# EAGLE schematic quad_fc_v1 (EAGLE 9.6.1)

## Sheet 1 of 5: MCU
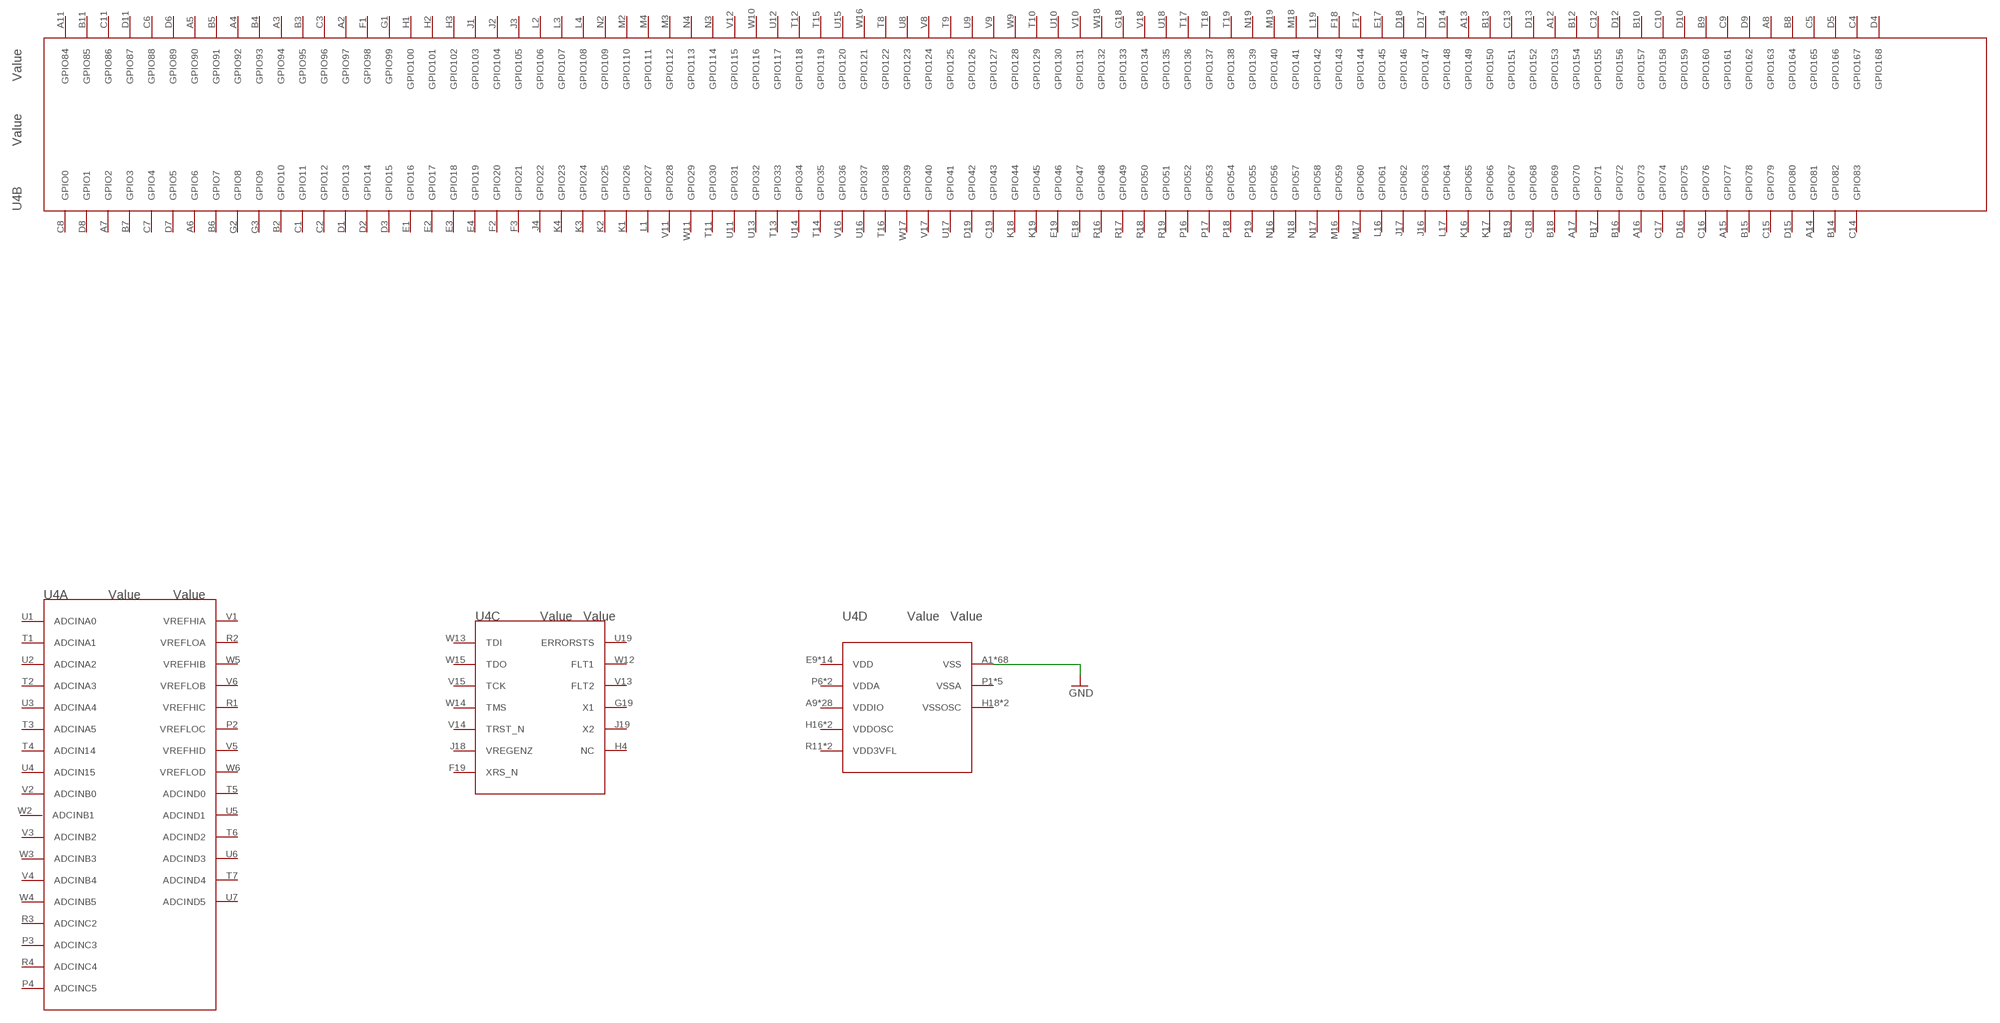
[diagram p0: schematic, sheet 1]

### Parts
U4  Value  TMS320F28379DZWTS  [ZWT0337A]

### Nets
GND: U4.A1(D:VSS) U4.A10(D:VSS) U4.A19(D:VSS) U4.E5(D:VSS) U4.E6(D:VSS) U4.E8(D:VSS) U4.E12(D:VSS) U4.E14(D:VSS) U4.E15(D:VSS) U4.F5(D:VSS) U4.F6(D:VSS) U4.F8(D:VSS) U4.F12(D:VSS) U4.F14(D:VSS) U4.F15(D:VSS) U4.G16(D:VSS) U4.G17(D:VSS) U4.H8(D:VSS) U4.H9(D:VSS) U4.H10(D:VSS) U4.H11(D:VSS) U4.H12(D:VSS) U4.H14(D:VSS) U4.H15(D:VSS) U4.J5(D:VSS) U4.J6(D:VSS) U4.J8(D:VSS) U4.J9(D:VSS) U4.J10(D:VSS) U4.J11(D:VSS) U4.J12(D:VSS) U4.K8(D:VSS) U4.K9(D:VSS) U4.K10(D:VSS) U4.K11(D:VSS) U4.K12(D:VSS) U4.K14(D:VSS) U4.K15(D:VSS) U4.L5(D:VSS) U4.L6(D:VSS) U4.L8(D:VSS) U4.L9(D:VSS) U4.L10(D:VSS) U4.L11(D:VSS) U4.L12(D:VSS) U4.L18(D:VSS) U4.M8(D:VSS) U4.M9(D:VSS) U4.M10(D:VSS) U4.M11(D:VSS) U4.M12(D:VSS) U4.M14(D:VSS) U4.M15(D:VSS) U4.N1(D:VSS) U4.N5(D:VSS) U4.N6(D:VSS) U4.P7(D:VSS) U4.P8(D:VSS) U4.P11(D:VSS) U4.P12(D:VSS) U4.P14(D:VSS) U4.P15(D:VSS) U4.R7(D:VSS) U4.R8(D:VSS) U4.R14(D:VSS) U4.R15(D:VSS) U4.W7(D:VSS) U4.W19(D:VSS)
Unconnected: U4.A2(B:GPIO97) U4.A3(B:GPIO94) U4.A4(B:GPIO92) U4.A5(B:GPIO90) U4.A6(B:GPIO6) U4.A7(B:GPIO2) U4.A8(B:GPIO163) U4.A11(B:GPIO84) U4.A12(B:GPIO153) U4.A13(B:GPIO149) U4.A14(B:GPIO81) U4.A15(B:GPIO77) U4.A16(B:GPIO73) U4.A17(B:GPIO70) U4.B2(B:GPIO10) U4.B3(B:GPIO95) U4.B4(B:GPIO93) U4.B5(B:GPIO91) U4.B6(B:GPIO7) U4.B7(B:GPIO3) U4.B8(B:GPIO164) U4.B9(B:GPIO160) U4.B10(B:GPIO157) U4.B11(B:GPIO85) U4.B12(B:GPIO154) U4.B13(B:GPIO150) U4.B14(B:GPIO82) U4.B15(B:GPIO78) U4.B16(B:GPIO72) U4.B17(B:GPIO71) U4.B18(B:GPIO69) U4.B19(B:GPIO67) U4.C1(B:GPIO11) U4.C2(B:GPIO12) U4.C3(B:GPIO96) U4.C4(B:GPIO167) U4.C5(B:GPIO165) U4.C6(B:GPIO88) U4.C7(B:GPIO4) U4.C8(B:GPIO0) U4.C9(B:GPIO161) U4.C10(B:GPIO158) U4.C11(B:GPIO86) U4.C12(B:GPIO155) U4.C13(B:GPIO151) U4.C14(B:GPIO83) U4.C15(B:GPIO79) U4.C16(B:GPIO76) U4.C17(B:GPIO74) U4.C18(B:GPIO68) U4.C19(B:GPIO43) U4.D1(B:GPIO13) U4.D2(B:GPIO14) U4.D3(B:GPIO15) U4.D4(B:GPIO168) U4.D5(B:GPIO166) U4.D6(B:GPIO89) U4.D7(B:GPIO5) U4.D8(B:GPIO1) U4.D9(B:GPIO162) U4.D10(B:GPIO159) U4.D11(B:GPIO87) U4.D12(B:GPIO156) U4.D13(B:GPIO152) U4.D14(B:GPIO148) U4.D15(B:GPIO80) U4.D16(B:GPIO75) U4.D17(B:GPIO147) U4.D18(B:GPIO146) U4.D19(B:GPIO42) U4.E1(B:GPIO16) U4.E2(B:GPIO17) U4.E3(B:GPIO18) U4.E4(B:GPIO19) U4.E17(B:GPIO145) U4.E18(B:GPIO47) U4.E19(B:GPIO46) U4.F1(B:GPIO98) U4.F2(B:GPIO20) U4.F3(B:GPIO21) U4.F17(B:GPIO144) U4.F18(B:GPIO143) U4.F19(C:XRS_N) U4.G1(B:GPIO99) U4.G2(B:GPIO8) U4.G3(B:GPIO9) U4.G18(B:GPIO133) U4.G19(C:X1) U4.H1(B:GPIO100) U4.H2(B:GPIO101) U4.H3(B:GPIO102) U4.H4(C:NC) U4.J1(B:GPIO103) U4.J2(B:GPIO104) U4.J3(B:GPIO105) U4.J4(B:GPIO22) U4.J16(B:GPIO63) U4.J17(B:GPIO62) U4.J18(C:VREGENZ) U4.J19(C:X2) U4.K1(B:GPIO26) U4.K2(B:GPIO25) U4.K3(B:GPIO24) U4.K4(B:GPIO23) U4.K16(B:GPIO65) U4.K17(B:GPIO66) U4.K18(B:GPIO44) U4.K19(B:GPIO45) U4.L1(B:GPIO27) U4.L2(B:GPIO106) U4.L3(B:GPIO107) U4.L4(B:GPIO108) U4.L16(B:GPIO61) U4.L17(B:GPIO64) U4.L19(B:GPIO142) U4.M2(B:GPIO110) U4.M3(B:GPIO112) U4.M4(B:GPIO111) U4.M16(B:GPIO59) U4.M17(B:GPIO60) U4.M18(B:GPIO141) U4.M19(B:GPIO140) U4.N2(B:GPIO109) U4.N3(B:GPIO114) U4.N4(B:GPIO113) U4.N16(B:GPIO56) U4.N17(B:GPIO58) U4.N18(B:GPIO57) U4.N19(B:GPIO139) U4.P2(A:VREFLOC) U4.P3(A:ADCINC3) U4.P4(A:ADCINC5) U4.P16(B:GPIO52) U4.P17(B:GPIO53) U4.P18(B:GPIO54) U4.P19(B:GPIO55) U4.R1(A:VREFHIC) U4.R2(A:VREFLOA) U4.R3(A:ADCINC2) U4.R4(A:ADCINC4) U4.R16(B:GPIO48) U4.R17(B:GPIO49) U4.R18(B:GPIO50) U4.R19(B:GPIO51) U4.T1(A:ADCINA1) U4.T2(A:ADCINA3) U4.T3(A:ADCINA5) U4.T4(A:ADCIN14) U4.T5(A:ADCIND0) U4.T6(A:ADCIND2) U4.T7(A:ADCIND4) U4.T8(B:GPIO122) U4.T9(B:GPIO125) U4.T10(B:GPIO129) U4.T11(B:GPIO30) U4.T12(B:GPIO118) U4.T13(B:GPIO33) U4.T14(B:GPIO35) U4.T15(B:GPIO119) U4.T16(B:GPIO38) U4.T17(B:GPIO136) U4.T18(B:GPIO137) U4.T19(B:GPIO138) U4.U1(A:ADCINA0) U4.U2(A:ADCINA2) U4.U3(A:ADCINA4) U4.U4(A:ADCIN15) U4.U5(A:ADCIND1) U4.U6(A:ADCIND3) U4.U7(A:ADCIND5) U4.U8(B:GPIO123) U4.U9(B:GPIO126) U4.U10(B:GPIO130) U4.U11(B:GPIO31) U4.U12(B:GPIO117) U4.U13(B:GPIO32) U4.U14(B:GPIO34) U4.U15(B:GPIO120) U4.U16(B:GPIO37) U4.U17(B:GPIO41) U4.U18(B:GPIO135) U4.U19(C:ERRORSTS) U4.V1(A:VREFHIA) U4.V2(A:ADCINB0) U4.V3(A:ADCINB2) U4.V4(A:ADCINB4) U4.V5(A:VREFHID) U4.V6(A:VREFLOB) U4.V8(B:GPIO124) U4.V9(B:GPIO127) U4.V10(B:GPIO131) U4.V11(B:GPIO28) U4.V12(B:GPIO115) U4.V13(C:FLT2) U4.V14(C:TRST_N) U4.V15(C:TCK) U4.V16(B:GPIO36) U4.V17(B:GPIO40) U4.V18(B:GPIO134) U4.W2(A:ADCINB1) U4.W3(A:ADCINB3) U4.W4(A:ADCINB5) U4.W5(A:VREFHIB) U4.W6(A:VREFLOD) U4.W9(B:GPIO128) U4.W10(B:GPIO116) U4.W11(B:GPIO29) U4.W12(C:FLT1) U4.W13(C:TDI) U4.W14(C:TMS) U4.W15(C:TDO) U4.W16(B:GPIO121) U4.W17(B:GPIO39) U4.W18(B:GPIO132)

## Sheet 2 of 5: IMU, Pressure, uSD
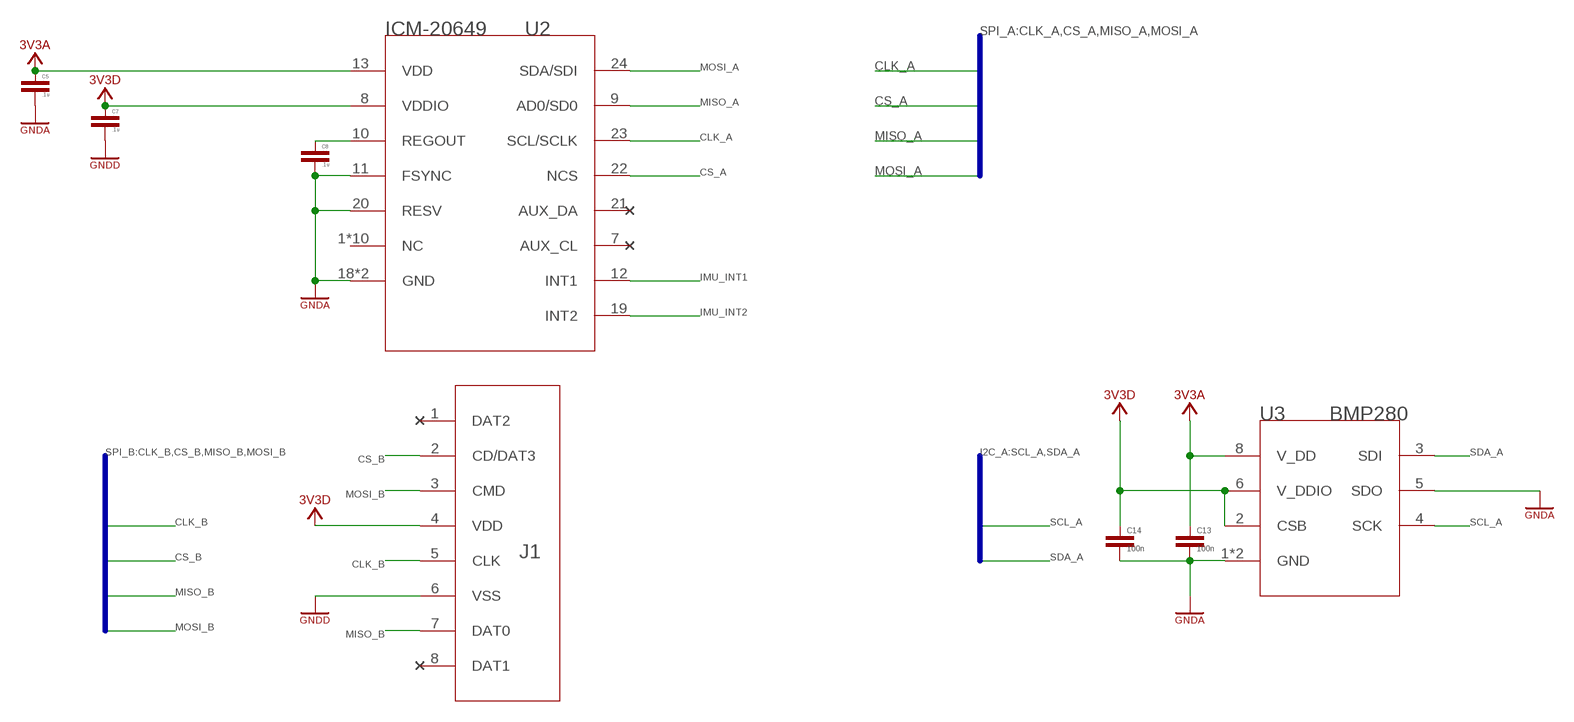
[diagram p1: schematic, sheet 2]

### Parts
C5  .1u  C-EUC0805  [C0805]
C7  .1u  C-EUC0805  [C0805]
C8  .1u  C-EUC0805  [C0805]
C13  100n  C-EUC0603  [C0603]
C14  100n  C-EUC0603  [C0603]
J1  DM3CS-SF  [CONN_3CS-SF]
U2  ICM-20649  [QFN24_3X3X0P9_IVS]
U3  BMP280  [LGA8_BMP280_BOS]

### Nets
3V3A: C5.1 C13.1 U2.13(VDD) U3.8(V_DD) ; also sheet 3
3V3D: C7.1 C14.1 J1.4(VDD) U2.8(VDDIO) U3.2(CSB) U3.6(V_DDIO) ; also sheet 3
CLK_A: U2.23(SCL/SCLK)
CLK_B: J1.5(CLK)
CS_A: U2.22(NCS)
CS_B: J1.2(CD/DAT3)
GNDA: C5.2 C8.2 C13.2 C14.2 U2.11(FSYNC) U2.18(GND) U2.20(RESV) U2.25(GND) U3.1(GND) U3.5(SDO) U3.7(GND) ; also sheet 3
GNDD: C7.2 J1.6(VSS)
IMU_INT1: U2.12(INT1)
IMU_INT2: U2.19(INT2)
MISO_A: U2.9(AD0/SD0)
MISO_B: J1.7(DAT0)
MOSI_A: U2.24(SDA/SDI)
MOSI_B: J1.3(CMD)
N$10: C8.1 U2.10(REGOUT)
SCL_A: U3.4(SCK)
SDA_A: U3.3(SDI)
Unconnected: J1.1(DAT2) J1.8(DAT1) U2.1(NC) U2.2(NC) U2.3(NC) U2.4(NC) U2.5(NC) U2.6(NC) U2.7(AUX_CL) U2.14(NC) U2.15(NC) U2.16(NC) U2.17(NC) U2.21(AUX_DA)

### Buses
SPI_A:CLK_A,CS_A,MISO_A,MOSI_A
I2C_A:SCL_A,SDA_A
SPI_B:CLK_B,CS_B,MISO_B,MOSI_B

## Sheet 3 of 5: Power
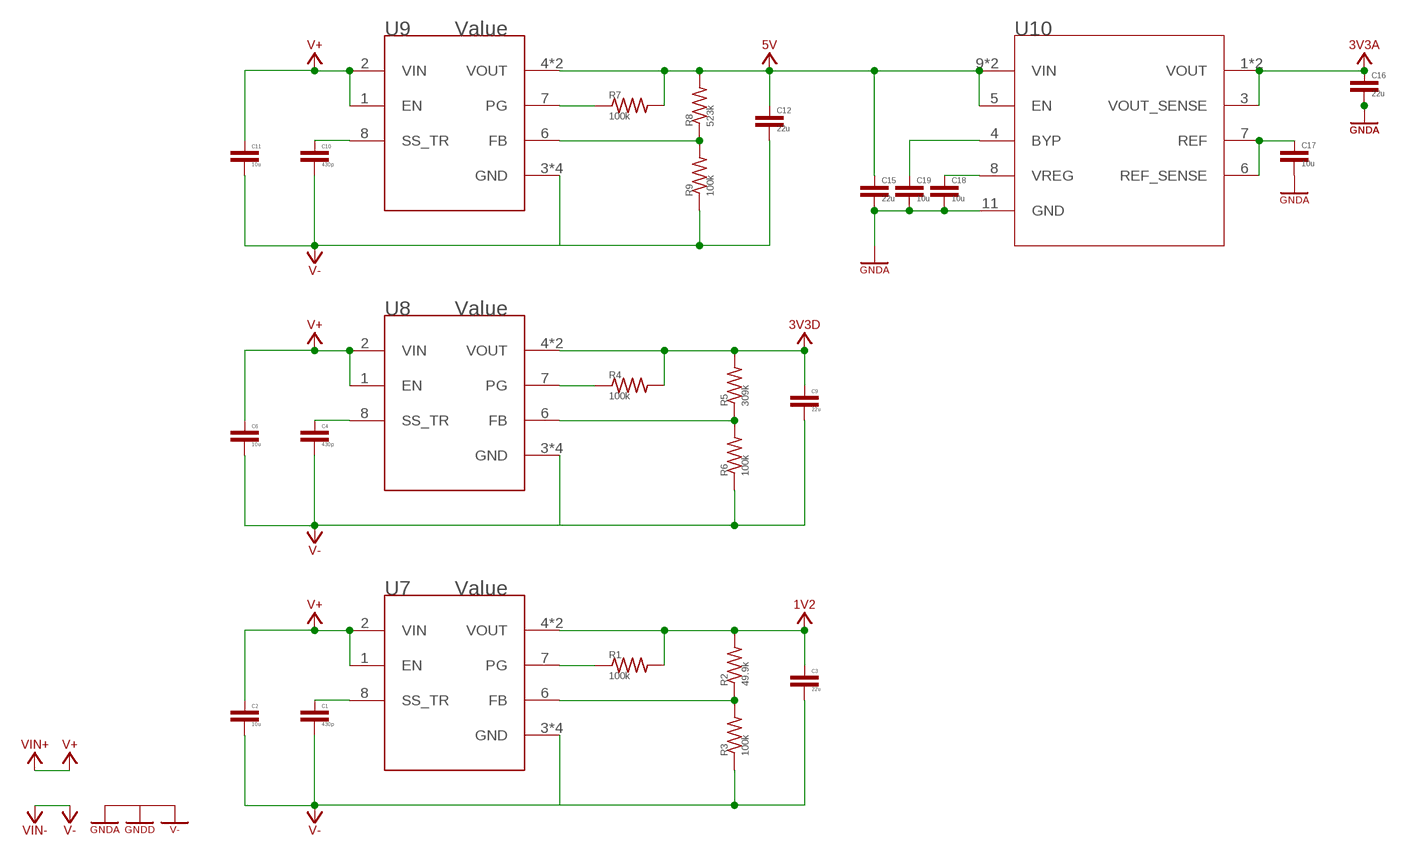
[diagram p2: schematic, sheet 3]

### Parts
C1  430p  C-EUC0603  [C0603]
C2  10u  C-EUC0603  [C0603]
C3  22u  C-EUC0805  [C0805]
C4  430p  C-EUC0603  [C0603]
C6  10u  C-EUC0603  [C0603]
C9  22u  C-EUC0805  [C0805]
C10  430p  C-EUC0603  [C0603]
C11  10u  C-EUC0603  [C0603]
C12  22u  C-EUC0805  [C0805]
C15  22u  C-EUC0805  [C0805]
C16  22u  C-EUC0805  [C0805]
C17  10u  C-EUC0603  [C0603]
C18  10u  C-EUC0603  [C0603]
C19  10u  C-EUC0603  [C0603]
R1  100k  R-US_R0603  [R0603]
R2  49.9k  R-US_R0603  [R0603]
R3  100k  R-US_R0603  [R0603]
R4  100k  R-US_R0603  [R0603]
R5  309k  R-US_R0603  [R0603]
R6  100k  R-US_R0603  [R0603]
R7  100k  R-US_R0603  [R0603]
R8  523k  R-US_R0603  [R0603]
R9  100k  R-US_R0603  [R0603]
U7  Value  TPS82150SILR  [SIL0008D_SMD]
U8  Value  TPS82150SILR  [SIL0008D_SMD]
U9  Value  TPS82150SILR  [SIL0008D_SMD]
U10  ADP7156ACPZ-3.3-R7CP_10_9_ADI-L  [CP_10_9_ADI-L]
U$1  VIN+  [BAT_SOLDER_PAD]
U$2  VIN-  [BAT_SOLDER_PAD]
U$6  STARGND  [STARGND]

### Nets
1V2: C3.1 R1.2 R2.2 U7.4(VOUT) U7.5(VOUT)
3V3A: C16.1 U10.1(VOUT) U10.2(VOUT) U10.3(VOUT_SENSE) ; also sheet 2
3V3D: C9.1 R4.2 R5.2 U8.4(VOUT) U8.5(VOUT) ; also sheet 2
5V: C12.1 C15.1 R7.2 R8.2 U9.4(VOUT) U9.5(VOUT) U10.5(EN) U10.9(VIN) U10.10(VIN) ; also sheet 4
GNDA: C15.2 C16.2 C17.2 C18.2 C19.2 U10.11(GND) ; also sheet 2
N$1: R2.1 R3.2 U7.6(FB)
N$2: C17.1 U10.6(REF_SENSE) U10.7(REF)
N$3: R1.1 U7.7(PG)
N$4: C1.1 U7.8(SS_TR)
N$5: U7.3(GND) U7.9(GND) U7.10(GND) U7.11(GND)
N$6: C18.1 U10.8(VREG)
N$7: R5.1 R6.2 U8.6(FB)
N$8: C19.1 U10.4(BYP)
N$9: R4.1 U8.7(PG)
N$11: C4.1 U8.8(SS_TR)
N$12: U8.3(GND) U8.9(GND) U8.10(GND) U8.11(GND)
N$13: R8.1 R9.2 U9.6(FB)
N$15: R7.1 U9.7(PG)
N$16: C10.1 U9.8(SS_TR)
N$17: U9.3(GND) U9.9(GND) U9.10(GND) U9.11(GND)
V+: C2.1 C6.1 C11.1 U7.1(EN) U7.2(VIN) U8.1(EN) U8.2(VIN) U9.1(EN) U9.2(VIN) ; also sheet 4
V-: C1.2 C2.2 C3.2 C4.2 C6.2 C9.2 C10.2 C11.2 C12.2 R3.1 R6.1 R9.1 ; also sheet 4
VIN+: U$1.V(VIN+) ; supply symbol labelled V+
VIN-: U$2.V(VIN-) ; supply symbol labelled V-
Unconnected: U$6.GNDA U$6.GNDD U$6.V-

## Sheet 4 of 5: nFETs
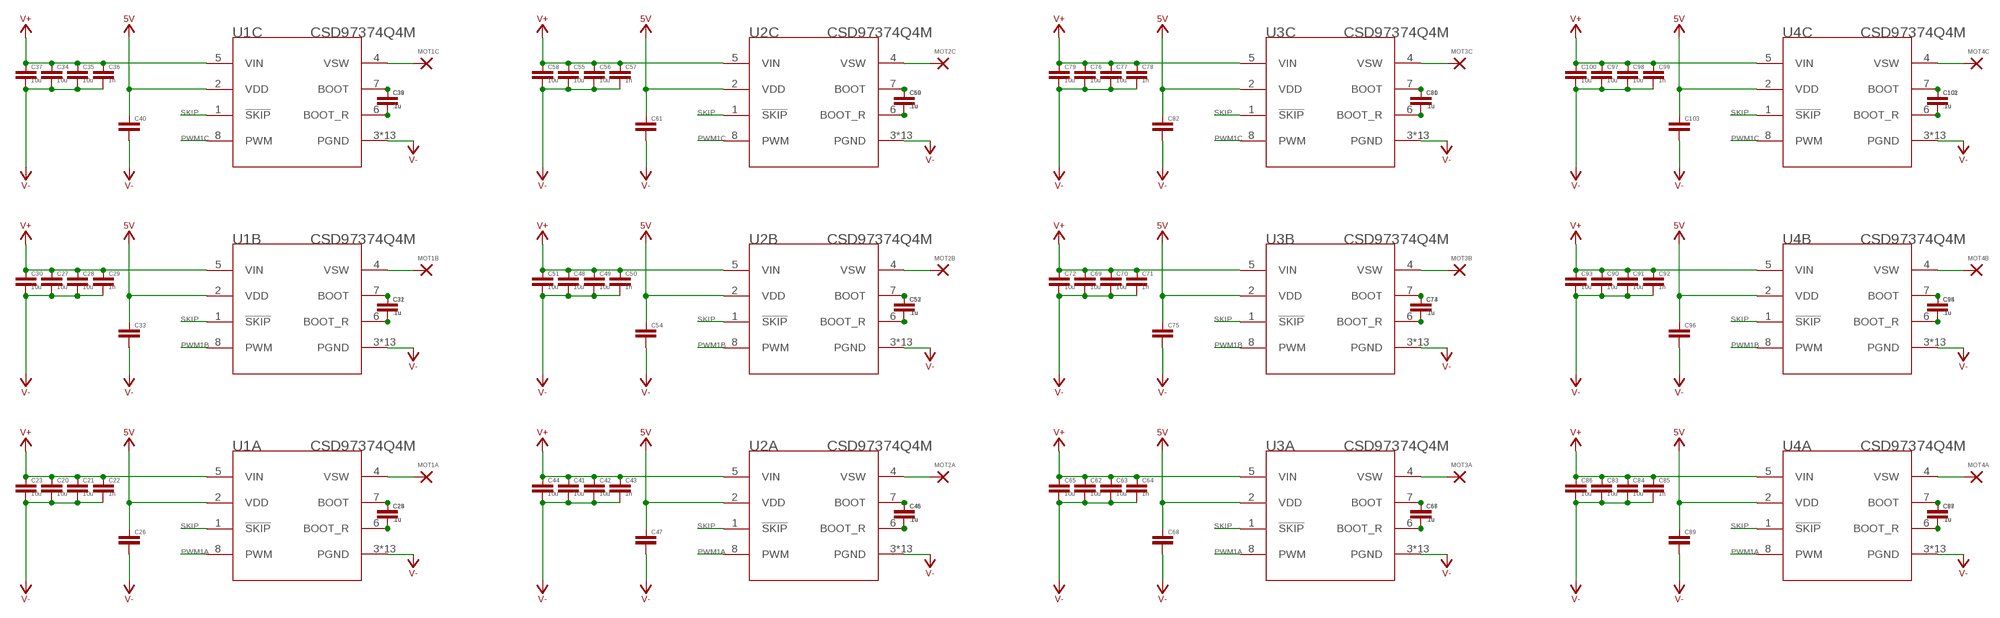
[diagram p3: schematic, sheet 4]

### Parts
C20  10u  C-EUC0603  [C0603]
C21  10u  C-EUC0603  [C0603]
C22  1n  C-EUC0603  [C0603]
C23  10u  C-EUC0603  [C0603]
C24  .1u  C-EUC0603  [C0603]
C25  .1u  C-EUC0603  [C0603]
C26  C-EUC0603  [C0603]
C27  10u  C-EUC0603  [C0603]
C28  10u  C-EUC0603  [C0603]
C29  1n  C-EUC0603  [C0603]
C30  10u  C-EUC0603  [C0603]
C31  .1u  C-EUC0603  [C0603]
C32  .1u  C-EUC0603  [C0603]
C33  C-EUC0603  [C0603]
C34  10u  C-EUC0603  [C0603]
C35  10u  C-EUC0603  [C0603]
C36  1n  C-EUC0603  [C0603]
C37  10u  C-EUC0603  [C0603]
C38  .1u  C-EUC0603  [C0603]
C39  .1u  C-EUC0603  [C0603]
C40  C-EUC0603  [C0603]
C41  10u  C-EUC0603  [C0603]
C42  10u  C-EUC0603  [C0603]
C43  1n  C-EUC0603  [C0603]
C44  10u  C-EUC0603  [C0603]
C45  .1u  C-EUC0603  [C0603]
C46  .1u  C-EUC0603  [C0603]
C47  C-EUC0603  [C0603]
C48  10u  C-EUC0603  [C0603]
C49  10u  C-EUC0603  [C0603]
C50  1n  C-EUC0603  [C0603]
C51  10u  C-EUC0603  [C0603]
C52  .1u  C-EUC0603  [C0603]
C53  .1u  C-EUC0603  [C0603]
C54  C-EUC0603  [C0603]
C55  10u  C-EUC0603  [C0603]
C56  10u  C-EUC0603  [C0603]
C57  1n  C-EUC0603  [C0603]
C58  10u  C-EUC0603  [C0603]
C59  .1u  C-EUC0603  [C0603]
C60  .1u  C-EUC0603  [C0603]
C61  C-EUC0603  [C0603]
C62  10u  C-EUC0603  [C0603]
C63  10u  C-EUC0603  [C0603]
C64  1n  C-EUC0603  [C0603]
C65  10u  C-EUC0603  [C0603]
C66  .1u  C-EUC0603  [C0603]
C67  .1u  C-EUC0603  [C0603]
C68  C-EUC0603  [C0603]
C69  10u  C-EUC0603  [C0603]
C70  10u  C-EUC0603  [C0603]
C71  1n  C-EUC0603  [C0603]
C72  10u  C-EUC0603  [C0603]
C73  .1u  C-EUC0603  [C0603]
C74  .1u  C-EUC0603  [C0603]
C75  C-EUC0603  [C0603]
C76  10u  C-EUC0603  [C0603]
C77  10u  C-EUC0603  [C0603]
C78  1n  C-EUC0603  [C0603]
C79  10u  C-EUC0603  [C0603]
C80  .1u  C-EUC0603  [C0603]
C81  .1u  C-EUC0603  [C0603]
C82  C-EUC0603  [C0603]
C83  10u  C-EUC0603  [C0603]
C84  10u  C-EUC0603  [C0603]
C85  1n  C-EUC0603  [C0603]
C86  10u  C-EUC0603  [C0603]
C87  .1u  C-EUC0603  [C0603]
C88  .1u  C-EUC0603  [C0603]
C89  C-EUC0603  [C0603]
C90  10u  C-EUC0603  [C0603]
C91  10u  C-EUC0603  [C0603]
C92  1n  C-EUC0603  [C0603]
C93  10u  C-EUC0603  [C0603]
C94  .1u  C-EUC0603  [C0603]
C95  .1u  C-EUC0603  [C0603]
C96  C-EUC0603  [C0603]
C97  10u  C-EUC0603  [C0603]
C98  10u  C-EUC0603  [C0603]
C99  1n  C-EUC0603  [C0603]
C100  10u  C-EUC0603  [C0603]
C101  .1u  C-EUC0603  [C0603]
C102  .1u  C-EUC0603  [C0603]
C103  C-EUC0603  [C0603]
MOT1A  MOT_SOLDER_PAD  [MOT_SOLDER_PAD]
MOT1B  MOT_SOLDER_PAD  [MOT_SOLDER_PAD]
MOT1C  MOT_SOLDER_PAD  [MOT_SOLDER_PAD]
MOT2A  MOT_SOLDER_PAD  [MOT_SOLDER_PAD]
MOT2B  MOT_SOLDER_PAD  [MOT_SOLDER_PAD]
MOT2C  MOT_SOLDER_PAD  [MOT_SOLDER_PAD]
MOT3A  MOT_SOLDER_PAD  [MOT_SOLDER_PAD]
MOT3B  MOT_SOLDER_PAD  [MOT_SOLDER_PAD]
MOT3C  MOT_SOLDER_PAD  [MOT_SOLDER_PAD]
MOT4A  MOT_SOLDER_PAD  [MOT_SOLDER_PAD]
MOT4B  MOT_SOLDER_PAD  [MOT_SOLDER_PAD]
MOT4C  MOT_SOLDER_PAD  [MOT_SOLDER_PAD]
U1A  CSD97374Q4M  [DPC8]
U1B  CSD97374Q4M  [DPC8]
U1C  CSD97374Q4M  [DPC8]
U2A  CSD97374Q4M  [DPC8]
U2B  CSD97374Q4M  [DPC8]
U2C  CSD97374Q4M  [DPC8]
U3A  CSD97374Q4M  [DPC8]
U3B  CSD97374Q4M  [DPC8]
U3C  CSD97374Q4M  [DPC8]
U4A  CSD97374Q4M  [DPC8]
U4B  CSD97374Q4M  [DPC8]
U4C  CSD97374Q4M  [DPC8]

### Nets
5V: C26.1 C33.1 C40.1 C47.1 C54.1 C61.1 C68.1 C75.1 C82.1 C89.1 C96.1 C103.1 U1A.2(VDD) U1B.2(VDD) U1C.2(VDD) U2A.2(VDD) U2B.2(VDD) U2C.2(VDD) U3A.2(VDD) U3B.2(VDD) U3C.2(VDD) U4A.2(VDD) U4B.2(VDD) U4C.2(VDD) ; also sheet 3
N$14: C24.1 C25.1 U1A.7(BOOT)
N$18: C24.2 C25.2 U1A.6(BOOT_R)
N$19: MOT1A.1(P) U1A.4(VSW)
N$20: C31.1 C32.1 U1B.7(BOOT)
N$21: C31.2 C32.2 U1B.6(BOOT_R)
N$22: MOT1B.1(P) U1B.4(VSW)
N$23: C38.1 C39.1 U1C.7(BOOT)
N$24: C38.2 C39.2 U1C.6(BOOT_R)
N$25: MOT1C.1(P) U1C.4(VSW)
N$26: C45.1 C46.1 U2A.7(BOOT)
N$27: C45.2 C46.2 U2A.6(BOOT_R)
N$28: MOT2A.1(P) U2A.4(VSW)
N$29: C52.1 C53.1 U2B.7(BOOT)
N$30: C52.2 C53.2 U2B.6(BOOT_R)
N$31: MOT2B.1(P) U2B.4(VSW)
N$32: C59.1 C60.1 U2C.7(BOOT)
N$33: C59.2 C60.2 U2C.6(BOOT_R)
N$34: MOT2C.1(P) U2C.4(VSW)
N$35: C66.1 C67.1 U3A.7(BOOT)
N$36: C66.2 C67.2 U3A.6(BOOT_R)
N$37: MOT3A.1(P) U3A.4(VSW)
N$38: C73.1 C74.1 U3B.7(BOOT)
N$39: C73.2 C74.2 U3B.6(BOOT_R)
N$40: MOT3B.1(P) U3B.4(VSW)
N$41: C80.1 C81.1 U3C.7(BOOT)
N$42: C80.2 C81.2 U3C.6(BOOT_R)
N$43: MOT3C.1(P) U3C.4(VSW)
N$44: C87.1 C88.1 U4A.7(BOOT)
N$45: C87.2 C88.2 U4A.6(BOOT_R)
N$46: MOT4A.1(P) U4A.4(VSW)
N$47: C94.1 C95.1 U4B.7(BOOT)
N$48: C94.2 C95.2 U4B.6(BOOT_R)
N$49: MOT4B.1(P) U4B.4(VSW)
N$50: C101.1 C102.1 U4C.7(BOOT)
N$51: C101.2 C102.2 U4C.6(BOOT_R)
N$52: MOT4C.1(P) U4C.4(VSW)
PWM1A: U1A.8(PWM) U2A.8(PWM) U3A.8(PWM) U4A.8(PWM)
PWM1B: U1B.8(PWM) U2B.8(PWM) U3B.8(PWM) U4B.8(PWM)
PWM1C: U1C.8(PWM) U2C.8(PWM) U3C.8(PWM) U4C.8(PWM)
SKIP: U1A.1(!SKIP) U1B.1(!SKIP) U1C.1(!SKIP) U2A.1(!SKIP) U2B.1(!SKIP) U2C.1(!SKIP) U3A.1(!SKIP) U3B.1(!SKIP) U3C.1(!SKIP) U4A.1(!SKIP) U4B.1(!SKIP) U4C.1(!SKIP)
V+: C20.1 C21.1 C22.1 C23.1 C27.1 C28.1 C29.1 C30.1 C34.1 C35.1 C36.1 C37.1 C41.1 C42.1 C43.1 C44.1 C48.1 C49.1 C50.1 C51.1 C55.1 C56.1 C57.1 C58.1 C62.1 C63.1 C64.1 C65.1 C69.1 C70.1 C71.1 C72.1 C76.1 C77.1 C78.1 C79.1 C83.1 C84.1 C85.1 C86.1 C90.1 C91.1 C92.1 C93.1 C97.1 C98.1 C99.1 C100.1 U1A.5(VIN) U1B.5(VIN) U1C.5(VIN) U2A.5(VIN) U2B.5(VIN) U2C.5(VIN) U3A.5(VIN) U3B.5(VIN) U3C.5(VIN) U4A.5(VIN) U4B.5(VIN) U4C.5(VIN) ; also sheet 3
V-: C20.2 C21.2 C22.2 C23.2 C26.2 C27.2 C28.2 C29.2 C30.2 C33.2 C34.2 C35.2 C36.2 C37.2 C40.2 C41.2 C42.2 C43.2 C44.2 C47.2 C48.2 C49.2 C50.2 C51.2 C54.2 C55.2 C56.2 C57.2 C58.2 C61.2 C62.2 C63.2 C64.2 C65.2 C68.2 C69.2 C70.2 C71.2 C72.2 C75.2 C76.2 C77.2 C78.2 C79.2 C82.2 C83.2 C84.2 C85.2 C86.2 C89.2 C90.2 C91.2 C92.2 C93.2 C96.2 C97.2 C98.2 C99.2 C100.2 C103.2 U1A.3(PGND) U1A.9(PGND) U1A.V10(PGND) U1A.V11(PGND) U1A.V12(PGND) U1A.V13(PGND) U1A.V14(PGND) U1A.V15(PGND) U1A.V16(PGND) U1A.V17(PGND) U1A.V18(PGND) U1A.V19(PGND) U1A.V20(PGND) U1B.3(PGND) U1B.9(PGND) U1B.V10(PGND) U1B.V11(PGND) U1B.V12(PGND) U1B.V13(PGND) U1B.V14(PGND) U1B.V15(PGND) U1B.V16(PGND) U1B.V17(PGND) U1B.V18(PGND) U1B.V19(PGND) U1B.V20(PGND) U1C.3(PGND) U1C.9(PGND) U1C.V10(PGND) U1C.V11(PGND) U1C.V12(PGND) U1C.V13(PGND) U1C.V14(PGND) U1C.V15(PGND) U1C.V16(PGND) U1C.V17(PGND) U1C.V18(PGND) U1C.V19(PGND) U1C.V20(PGND) U2A.3(PGND) U2A.9(PGND) U2A.V10(PGND) U2A.V11(PGND) U2A.V12(PGND) U2A.V13(PGND) U2A.V14(PGND) U2A.V15(PGND) U2A.V16(PGND) U2A.V17(PGND) U2A.V18(PGND) U2A.V19(PGND) U2A.V20(PGND) U2B.3(PGND) U2B.9(PGND) U2B.V10(PGND) U2B.V11(PGND) U2B.V12(PGND) U2B.V13(PGND) U2B.V14(PGND) U2B.V15(PGND) U2B.V16(PGND) U2B.V17(PGND) U2B.V18(PGND) U2B.V19(PGND) U2B.V20(PGND) U2C.3(PGND) U2C.9(PGND) U2C.V10(PGND) U2C.V11(PGND) U2C.V12(PGND) U2C.V13(PGND) U2C.V14(PGND) U2C.V15(PGND) U2C.V16(PGND) U2C.V17(PGND) U2C.V18(PGND) U2C.V19(PGND) U2C.V20(PGND) U3A.3(PGND) U3A.9(PGND) U3A.V10(PGND) U3A.V11(PGND) U3A.V12(PGND) U3A.V13(PGND) U3A.V14(PGND) U3A.V15(PGND) U3A.V16(PGND) U3A.V17(PGND) U3A.V18(PGND) U3A.V19(PGND) U3A.V20(PGND) U3B.3(PGND) U3B.9(PGND) U3B.V10(PGND) U3B.V11(PGND) U3B.V12(PGND) U3B.V13(PGND) U3B.V14(PGND) U3B.V15(PGND) U3B.V16(PGND) U3B.V17(PGND) U3B.V18(PGND) U3B.V19(PGND) U3B.V20(PGND) U3C.3(PGND) U3C.9(PGND) U3C.V10(PGND) U3C.V11(PGND) U3C.V12(PGND) U3C.V13(PGND) U3C.V14(PGND) U3C.V15(PGND) U3C.V16(PGND) U3C.V17(PGND) U3C.V18(PGND) U3C.V19(PGND) U3C.V20(PGND) U4A.3(PGND) U4A.9(PGND) U4A.V10(PGND) U4A.V11(PGND) U4A.V12(PGND) U4A.V13(PGND) U4A.V14(PGND) U4A.V15(PGND) U4A.V16(PGND) U4A.V17(PGND) U4A.V18(PGND) U4A.V19(PGND) U4A.V20(PGND) U4B.3(PGND) U4B.9(PGND) U4B.V10(PGND) U4B.V11(PGND) U4B.V12(PGND) U4B.V13(PGND) U4B.V14(PGND) U4B.V15(PGND) U4B.V16(PGND) U4B.V17(PGND) U4B.V18(PGND) U4B.V19(PGND) U4B.V20(PGND) U4C.3(PGND) U4C.9(PGND) U4C.V10(PGND) U4C.V11(PGND) U4C.V12(PGND) U4C.V13(PGND) U4C.V14(PGND) U4C.V15(PGND) U4C.V16(PGND) U4C.V17(PGND) U4C.V18(PGND) U4C.V19(PGND) U4C.V20(PGND) ; also sheet 3

## Sheet 5 of 5: Comms

## Power pins joined to a net without a drawn wire
VDD: U4.E9(D:VDD) U4.E11(D:VDD) U4.F9(D:VDD) U4.F11(D:VDD) U4.G14(D:VDD) U4.G15(D:VDD) U4.J14(D:VDD) U4.J15(D:VDD) U4.K5(D:VDD) U4.K6(D:VDD) U4.P10(D:VDD) U4.P13(D:VDD) U4.R10(D:VDD) U4.R13(D:VDD)
VDD3VFL: U4.R11(D:VDD3VFL) U4.R12(D:VDD3VFL)
VDDA: U4.P6(D:VDDA) U4.R6(D:VDDA)
VDDIO: U4.A9(D:VDDIO) U4.A18(D:VDDIO) U4.B1(D:VDDIO) U4.E7(D:VDDIO) U4.E10(D:VDDIO) U4.E13(D:VDDIO) U4.E16(D:VDDIO) U4.F4(D:VDDIO) U4.F7(D:VDDIO) U4.F10(D:VDDIO) U4.F13(D:VDDIO) U4.F16(D:VDDIO) U4.G4(D:VDDIO) U4.G5(D:VDDIO) U4.G6(D:VDDIO) U4.H5(D:VDDIO) U4.H6(D:VDDIO) U4.L14(D:VDDIO) U4.L15(D:VDDIO) U4.M1(D:VDDIO) U4.M5(D:VDDIO) U4.M6(D:VDDIO) U4.N14(D:VDDIO) U4.N15(D:VDDIO) U4.P9(D:VDDIO) U4.R9(D:VDDIO) U4.V19(D:VDDIO) U4.W8(D:VDDIO)
VDDOSC: U4.H16(D:VDDOSC) U4.H17(D:VDDOSC)
VSSA: U4.P1(D:VSSA) U4.P5(D:VSSA) U4.R5(D:VSSA) U4.V7(D:VSSA) U4.W1(D:VSSA)
VSSOSC: U4.H18(D:VSSOSC) U4.H19(D:VSSOSC)

## Library data of the parts
C1-C103 = QUAD_Passives:C-EU: CAPACITOR, European symbol; SPICEPREFIX: C
J1 = QUAD:DM3CS-SF: Micro SD card reader; BUILT_BY: EMA_Matt; COPYRIGHT: Copyright (C) 2018 Accelerated Designs. All rights reserved; MANUFACTURER_PART_NUMBER: DM3CS-SF; VENDOR: Hirose
MOT1A MOT1B MOT1C MOT2A MOT2B MOT2C MOT3A MOT3B MOT3C MOT4A MOT4B MOT4C = QUAD_Connectors_Symbols:MOT_SOLDER_PAD: SMD PAD
R1-R9 = QUAD_Passives:R-US_: RESISTOR, American symbol; SPICEPREFIX: R
U1A U1B U1C U2A U2B U2C U3A U3B U3C U4A U4B U4C = QUAD_ICs:CSD97374Q4M: nFET Synchronous Buck NexFET Power Stage CSD97374Q4M; MANUFACTURER_PART_NUMBER: CSD97374Q4M; VENDOR: TEXAS INSTRUMENTS
U2 = QUAD:ICM-20649: IMU; BUILT_BY: EMA_Cory; COPYRIGHT: Copyright (C) 2018 Accelerated Designs. All rights reserved; MANUFACTURER_PART_NUMBER: ICM-20649; SOURCELIBRARY: InvenSense_2019-12-03; VENDOR: IvenSense
U3 = QUAD_ICs:BMP280: Barometer BMP280 Product Page <https://www.bosch-sensortec.com/products/environmental-sensors/pressure-sensors/pressure-sensors-bmp280-1.html>; BUILT_BY: EMA_Kyle; COPYRIGHT: Copyright (C) 2018 Accelerated Designs. All rights reserved; MANUFACTURER_PART_NUMBER: BMP280; SOURCELIBRARY: Bosch_Sensortec_2020-02-14; VENDOR: Bosch
U4 = QUAD:TMS320F28379DZWTS; MANUFACTURER: Texas Instruments; PARTNUMBER: TMS320F28379DZWTS; REFDES: RefDes; TYPE: TYPE
U7-U9 = QUAD_ICs:TPS82150SILR: Buck converter TPS 82150 17-V Input 1-A Step-Down Converter MicroSiP Module with Integrated Inductor; MANUFACTURER: Texas Instruments; PARTNUMBER: TPS82150SILR; REFDES: RefDes; TYPE: TYPE
U10 = QUAD_ICs:ADP7156ACPZ-3.3-R7: LDO 3.3V Analog 1.2 A, Ultralow Noise, High PSRR, RF Linear Regulator; BUILT_BY: Analog Devices Inc.; MANUFACTURER_PART_NUMBER: ADP7156ACPZ-2.5-R7; SOURCELIBRARY: Analog_2017-10-24; VENDOR: Analog Devices Inc
U$1 = QUAD_Connectors_Symbols:VIN+
U$2 = QUAD_Connectors_Symbols:VIN-
U$6 = QUAD_Connectors_Symbols:STARGND